# Altium schematic sheet pca10201_leds_and_buttons.SchDoc: =BoardTitle + ' - LEDs and Buttons'
size A3; Organization: Nordic Semiconductor; DocumentNumber: 4; SheetNumber: 4; SheetTotal: 10; CompanyName: Nordic Semiconductor; DocumentSize: A3
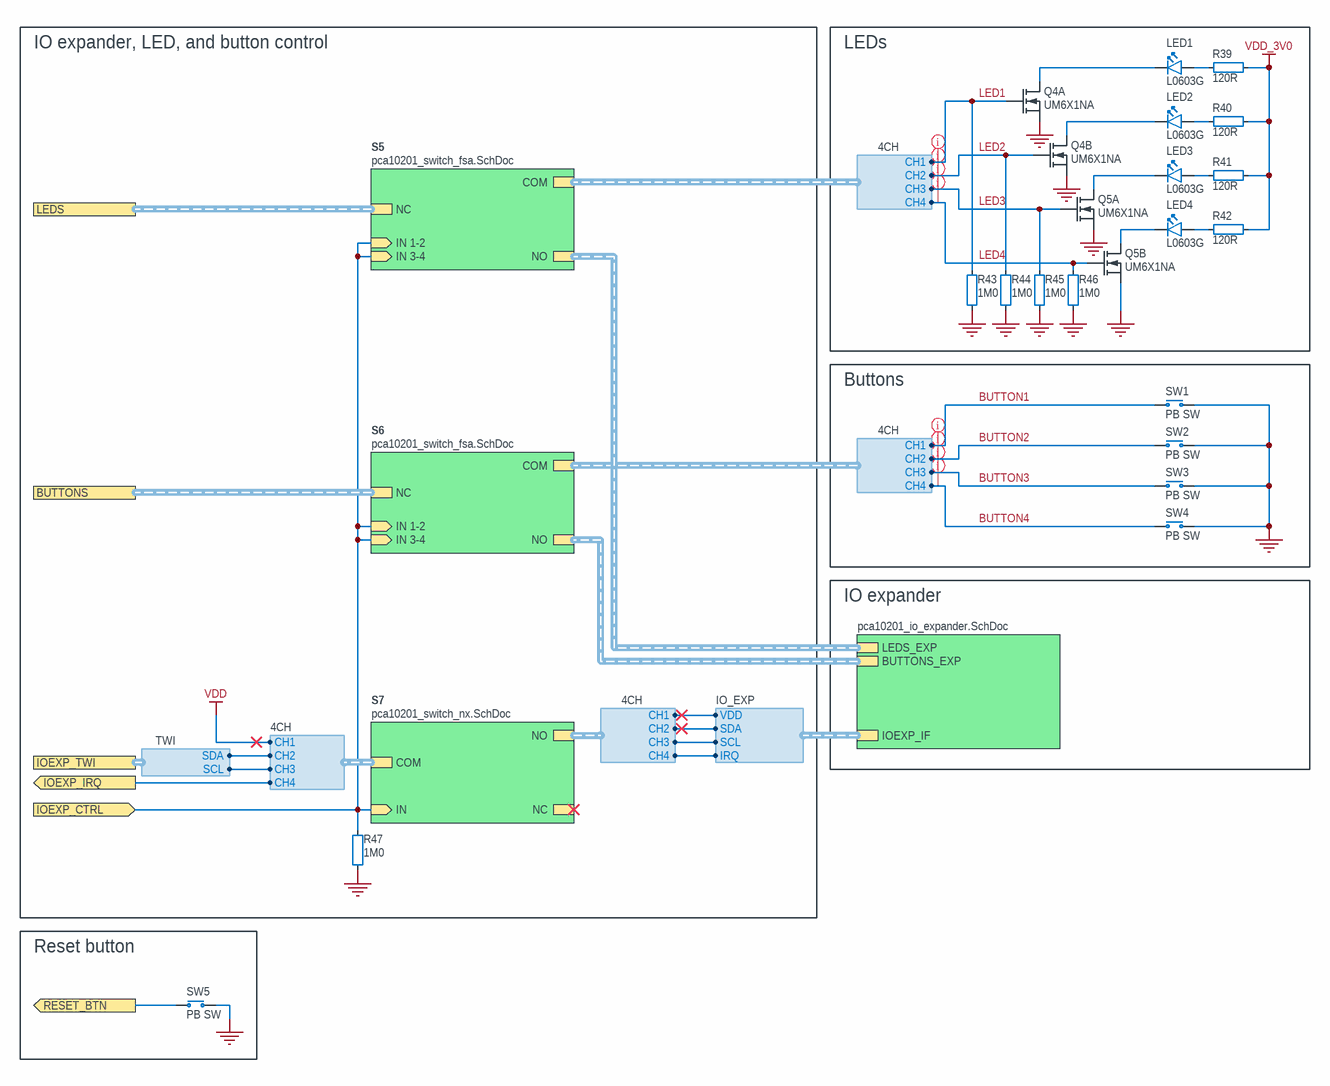
[diagram p0: pca10201_leds_and_buttons.SchDoc]

## Parts
LED1  L0603G  [LED_0603_G]
LED2  L0603G  [LED_0603_G]
LED3  L0603G  [LED_0603_G]
LED4  L0603G  [LED_0603_G]
Q4  UM6X1NA  [SOTFL50P162X60-6N]  (parts A,B of 2)
Q5  UM6X1NA  [SOTFL50P162X60-6N]  (parts A,B of 2)
R39  120R  [RESC0603X03L_C]
R40  120R  [RESC0603X03L_C]
R41  120R  [RESC0603X03L_C]
R42  120R  [RESC0603X03L_C]
R43  1M0  [RESC0603X03L_C]
R44  1M0  [RESC0603X03L_C]
R45  1M0  [RESC0603X03L_C]
R46  1M0  [RESC0603X03L_C]
R47  1M0  [RESC0603X03L_C]
SW1  PB SW  [L-KLS7-TS6616B-2.5-160-T]
SW2  PB SW  [L-KLS7-TS6616B-2.5-160-T]
SW3  PB SW  [L-KLS7-TS6616B-2.5-160-T]
SW4  PB SW  [L-KLS7-TS6616B-2.5-160-T]
SW5  PB SW  [L-KLS7-TS6616B-2.5-160-T]

## Blocks framed on the sheet
IO expander, LED, and button control: R47
LEDs: LED1-LED4 Q4 Q5 R39-R46
Buttons: SW1-SW4
Reset button: SW5

## Sub-sheets
Designator = pca10201_io_expander.SchDoc: LEDS_EXP (harness 4CH), BUTTONS_EXP (harness 4CH), IOEXP_IF (harness IO_EXP)
S5 = pca10201_switch_fsa.SchDoc: IN 1-2 (in), COM (harness 4CH), NC (harness 4CH), NO (harness 4CH), IN 3-4 (in)
S6 = pca10201_switch_fsa.SchDoc: IN 1-2 (in), COM (harness 4CH), NC (harness 4CH), NO (harness 4CH), IN 3-4 (in)
S7 = pca10201_switch_nx.SchDoc: IN (in), COM (harness 4CH), NC (harness 4CH), NO (harness 4CH)

## Ports
BUTTONS (harness 4CH), IOEXP_CTRL (in), IOEXP_IRQ (out), IOEXP_TWI (harness TWI), LEDS (harness 4CH), RESET_BTN (out)

## Harnesses
4CH: CH1, CH2, CH3, CH4
IO_EXP: VDD, SCL, SDA, IRQ
TWI: SCL, SDA

## Nets
GND: Q4.1(S1) Q4.4(S2) Q5.1(S1) Q5.4(S2) R43.1 R44.1 R45.1 R46.1 R47.1 SW1.1(N.O) SW2.1(N.O) SW3.1(N.O) SW4.1(N.O) SW5.1(N.O)
VDD: sheet S7/COM.CH1
VDD_3V0: R39.2 R40.2 R41.2 R42.2
BUTTON1: SW1.2(COM) ; sheet S6/COM.CH1
BUTTON2: SW2.2(COM) ; sheet S6/COM.CH2
BUTTON3: SW3.2(COM) ; sheet S6/COM.CH3
BUTTON4: SW4.2(COM) ; sheet S6/COM.CH4
IOEXP_CTRL: R47.2 ; port IOEXP_CTRL, sheet S5/IN 1-2, sheet S5/IN 3-4, sheet S6/IN 1-2, sheet S6/IN 3-4, sheet S7/IN
IOEXP_IRQ: port IOEXP_IRQ, sheet S7/COM.CH4
LED1: Q4.2(G1) R43.2 ; sheet S5/COM.CH1
LED2: Q4.5(G2) R44.2 ; sheet S5/COM.CH2
LED3: Q5.2(G1) R45.2 ; sheet S5/COM.CH3
LED4: Q5.5(G2) R46.2 ; sheet S5/COM.CH4
RESET_BTN: SW5.2(COM) ; port RESET_BTN
NetLED1_1: LED1.1(C) Q4.6(D1)
NetLED1_2: LED1.2(A) R39.1
NetLED2_1: LED2.1(C) Q4.3(D2)
NetLED2_2: LED2.2(A) R40.1
NetLED3_1: LED3.1(C) Q5.6(D1)
NetLED3_2: LED3.2(A) R41.1
NetLED4_1: LED4.1(C) Q5.3(D2)
NetLED4_2: LED4.2(A) R42.1
(unnamed): sheet S7/NO.CH1, sheet Designator/IOEXP_IF.VDD
(unnamed): sheet S7/NO.CH2, sheet Designator/IOEXP_IF.SDA
(unnamed): sheet S7/NO.CH3, sheet Designator/IOEXP_IF.SCL
(unnamed): sheet S7/NO.CH4, sheet Designator/IOEXP_IF.IRQ
(unnamed): sheet S7/COM.CH2, port IOEXP_TWI.SDA
(unnamed): sheet S7/COM.CH3, port IOEXP_TWI.SCL

## Buses and harness runs
harness port BUTTONS = sheet S6/NC
harness port LEDS = sheet S5/NC
harness sheet Designator/BUTTONS_EXP = sheet S6/NO
harness sheet Designator/LEDS_EXP = sheet S5/NO

## Layout directives
net class GPIO: BUTTON1, BUTTON2, BUTTON3, BUTTON4, LED1, LED2, LED3, LED4

## Notes on the sheet
- IO expander
- Title
- Size
- Date:
- File:
- A3
- PCB Assembly Number
- Sheet
- Drawn By:
- Revision
- of
- Classification:

## Library data of the parts
LED1-LED4 = VS 25C7M5: LED, Green, 0603, 573nm, Vf=2.0V, 24mcd, - 40 to +85°C; Manufacturer: Victory Electronics; Part number IPS: 00000001274, 00000009961; Part number Norautron: 26313411; Part number NEMS: 101400097; Note: N.A.; Artikkelnr Noca: 13019193; Pad Count: 2; Component Status: Active; Part Number: VS 25C7M5; Manufacturer Part Number: VS 25C7M5; Footprint Doc: 0603; LatestRevisionDate: 2020-10-23; Published: 2017-08-21; Value: L0603G; ComponentLink1URL: N.A.; ComponentLink1Description: Datasheet; ComponentLink2URL: N.A.; ComponentLink2Description: Supplier link; HelpURL: \\hizz\pro\app9717\Datasheet\optoelectronics\Victory Electronics\VS 25C7M5.pdf; Supplier 1: EC Partner; Supplier Part Number 1: N.A.; Supplier 2: N.A.; Supplier Part Number 2: N.A.; PartId: 101400097; Component Class: Optoelectronics; Author: rsk
Q4 Q5 = UM6X1NA: Dual N-Channel MOSFET, Vds = 30V, Vgs(th) = 1.5V, Id = 0.5A, Rds = 750mOhm, Pd = 150mW, -55°C ~ 150°C; Manufacturer: Micro Commercial Components; Manufacturer Part Number: UM6X1NA-TP; Part number NEMS: 101300201; Note: N.A.; Pad Count: 6; Component Status: Active; Part Number: UM6X1NA; ComponentLink1URL: https://www.mccsemi.com/pdf/Products/UM6X1NA(SOT-563).pdf; ComponentLink1Description: Datasheet; ComponentLink2URL: https://www.digikey.com/en/products/detail/micro-commercial-co/UM6X1NA-TP/16399159; ComponentLink2Description: Supplier link; HelpURL: https://www.mccsemi.com/product-detail/UM6X1NA; Footprint Doc: SOT-563; LatestRevisionDate: 2024-09-18; Published: 2023-01-19; Value: UM6X1NA; Supplier 1: Digi-Key; Supplier Part Number 1: 353-UM6X1NA-TPCT-ND; Supplier 2: Mouser; Supplier Part Number 2: 833-UM6X1NA-TP; Artikkelnr Noca: N.A.; Part number IPS: N.A.; Component Class: Semiconductors; Author: rubr; Part number Norautron: N.A.; PartId: 101300201
R39-R42 = R0201-120: Resistor, ±1%, 0.05W; Manufacturer: N.A.; Part number IPS: 00000000880; Part number Norautron: 26107076; Part number NEMS: 100100028; Note: Chip Res 1%; Pad Count: 2; Component Status: Active; Part Number: R0201-120; Manufacturer Part Number: N.A.; ComponentLink1URL: N.A.; ComponentLink1Description: Datasheet; ComponentLink2URL: N.A.; ComponentLink2Description: Supplier link; HelpURL: N.A.; Footprint Doc: 0201; LatestRevisionDate: 2014-11-13; Published: 2014-11-13; Value: 120R; Supplier 1: N.A.; Supplier Part Number 1: N.A.; Supplier 2: N.A.; Supplier Part Number 2: N.A.; Artikkelnr Noca: N.A.; PartId: 100100028; Component Class: Resistors; Author: rsk
R43-R47 = R0201-1M0: Resistor, ±1%, 0.05W; Manufacturer: N.A.; Part number IPS: 00000001418; Part number Norautron: 26107108; Part number NEMS: 100100093; Note: Chip Res 1%; Pad Count: 2; Component Status: Active; Part Number: R0201-1M0; Manufacturer Part Number: N.A.; ComponentLink1URL: N.A.; ComponentLink1Description: Datasheet; ComponentLink2URL: N.A.; ComponentLink2Description: Supplier link; HelpURL: N.A.; Footprint Doc: 0201; LatestRevisionDate: 2014-11-13; Published: 2014-11-13; Value: 1M0; Supplier 1: N.A.; Supplier Part Number 1: N.A.; Supplier 2: N.A.; Supplier Part Number 2: N.A.; Artikkelnr Noca: N.A.; PartId: 100100093; Component Class: Resistors; Author: rsk
SW1-SW5 = L-KLS7-TS6616B-2.5-160-T: Tactile Switch, SPNO, SMD, 160gf, 6.2x6.4x2.5mm; Manufacturer: KLS; Part number NEMS: 101500133, 101500001; Note: N.A.; Pad Count: 4; Component Status: Active; Part Number: L-KLS7-TS6616B-2.5-160-T; Manufacturer Part Number: L-KLS7-TS6616B-2.5-160-T; LatestRevisionDate: 2021-07-02; Published: 2021-07-02; Value: PB SW; Artikkelnr Noca: N.A.; ComponentLink1URL: N.A.; ComponentLink1Description: Datasheet; ComponentLink2URL: N.A.; ComponentLink2Description: Supplier link; HelpURL: \\hizz\pro\app9717\Datasheet\switches\KLS\L-KLS7-TS6616B-2.5-160-T.pdf; Footprint Doc: L-KLS7-TS6616B-2.5-160-T; Supplier 1: Cabcon; Supplier Part Number 1: L-KLS7-TS6616B-2.5-160-T; Supplier 2: N.A.; Supplier Part Number 2: N.A.; Part number IPS: N.A.; PartId: 101500133; Component Class: Switches; Author: masi; Part number Norautron: N.A.